# Altium schematic sheet EEM_Connectors.SchDoc
size 420 x 297 mm; EDA_Number: ARTIQ; CompanyName: WUT ISE; Organization: WUT ISE; DocumentNumber: 5; SheetNumber: 11; Title2: EEM Connectors, JTAG switches; SPICEModelCacheVGBTAUBO: <root> / <DocumentId>VGBTAUBO</DocumentId> / </root>; ModifiedDate: -
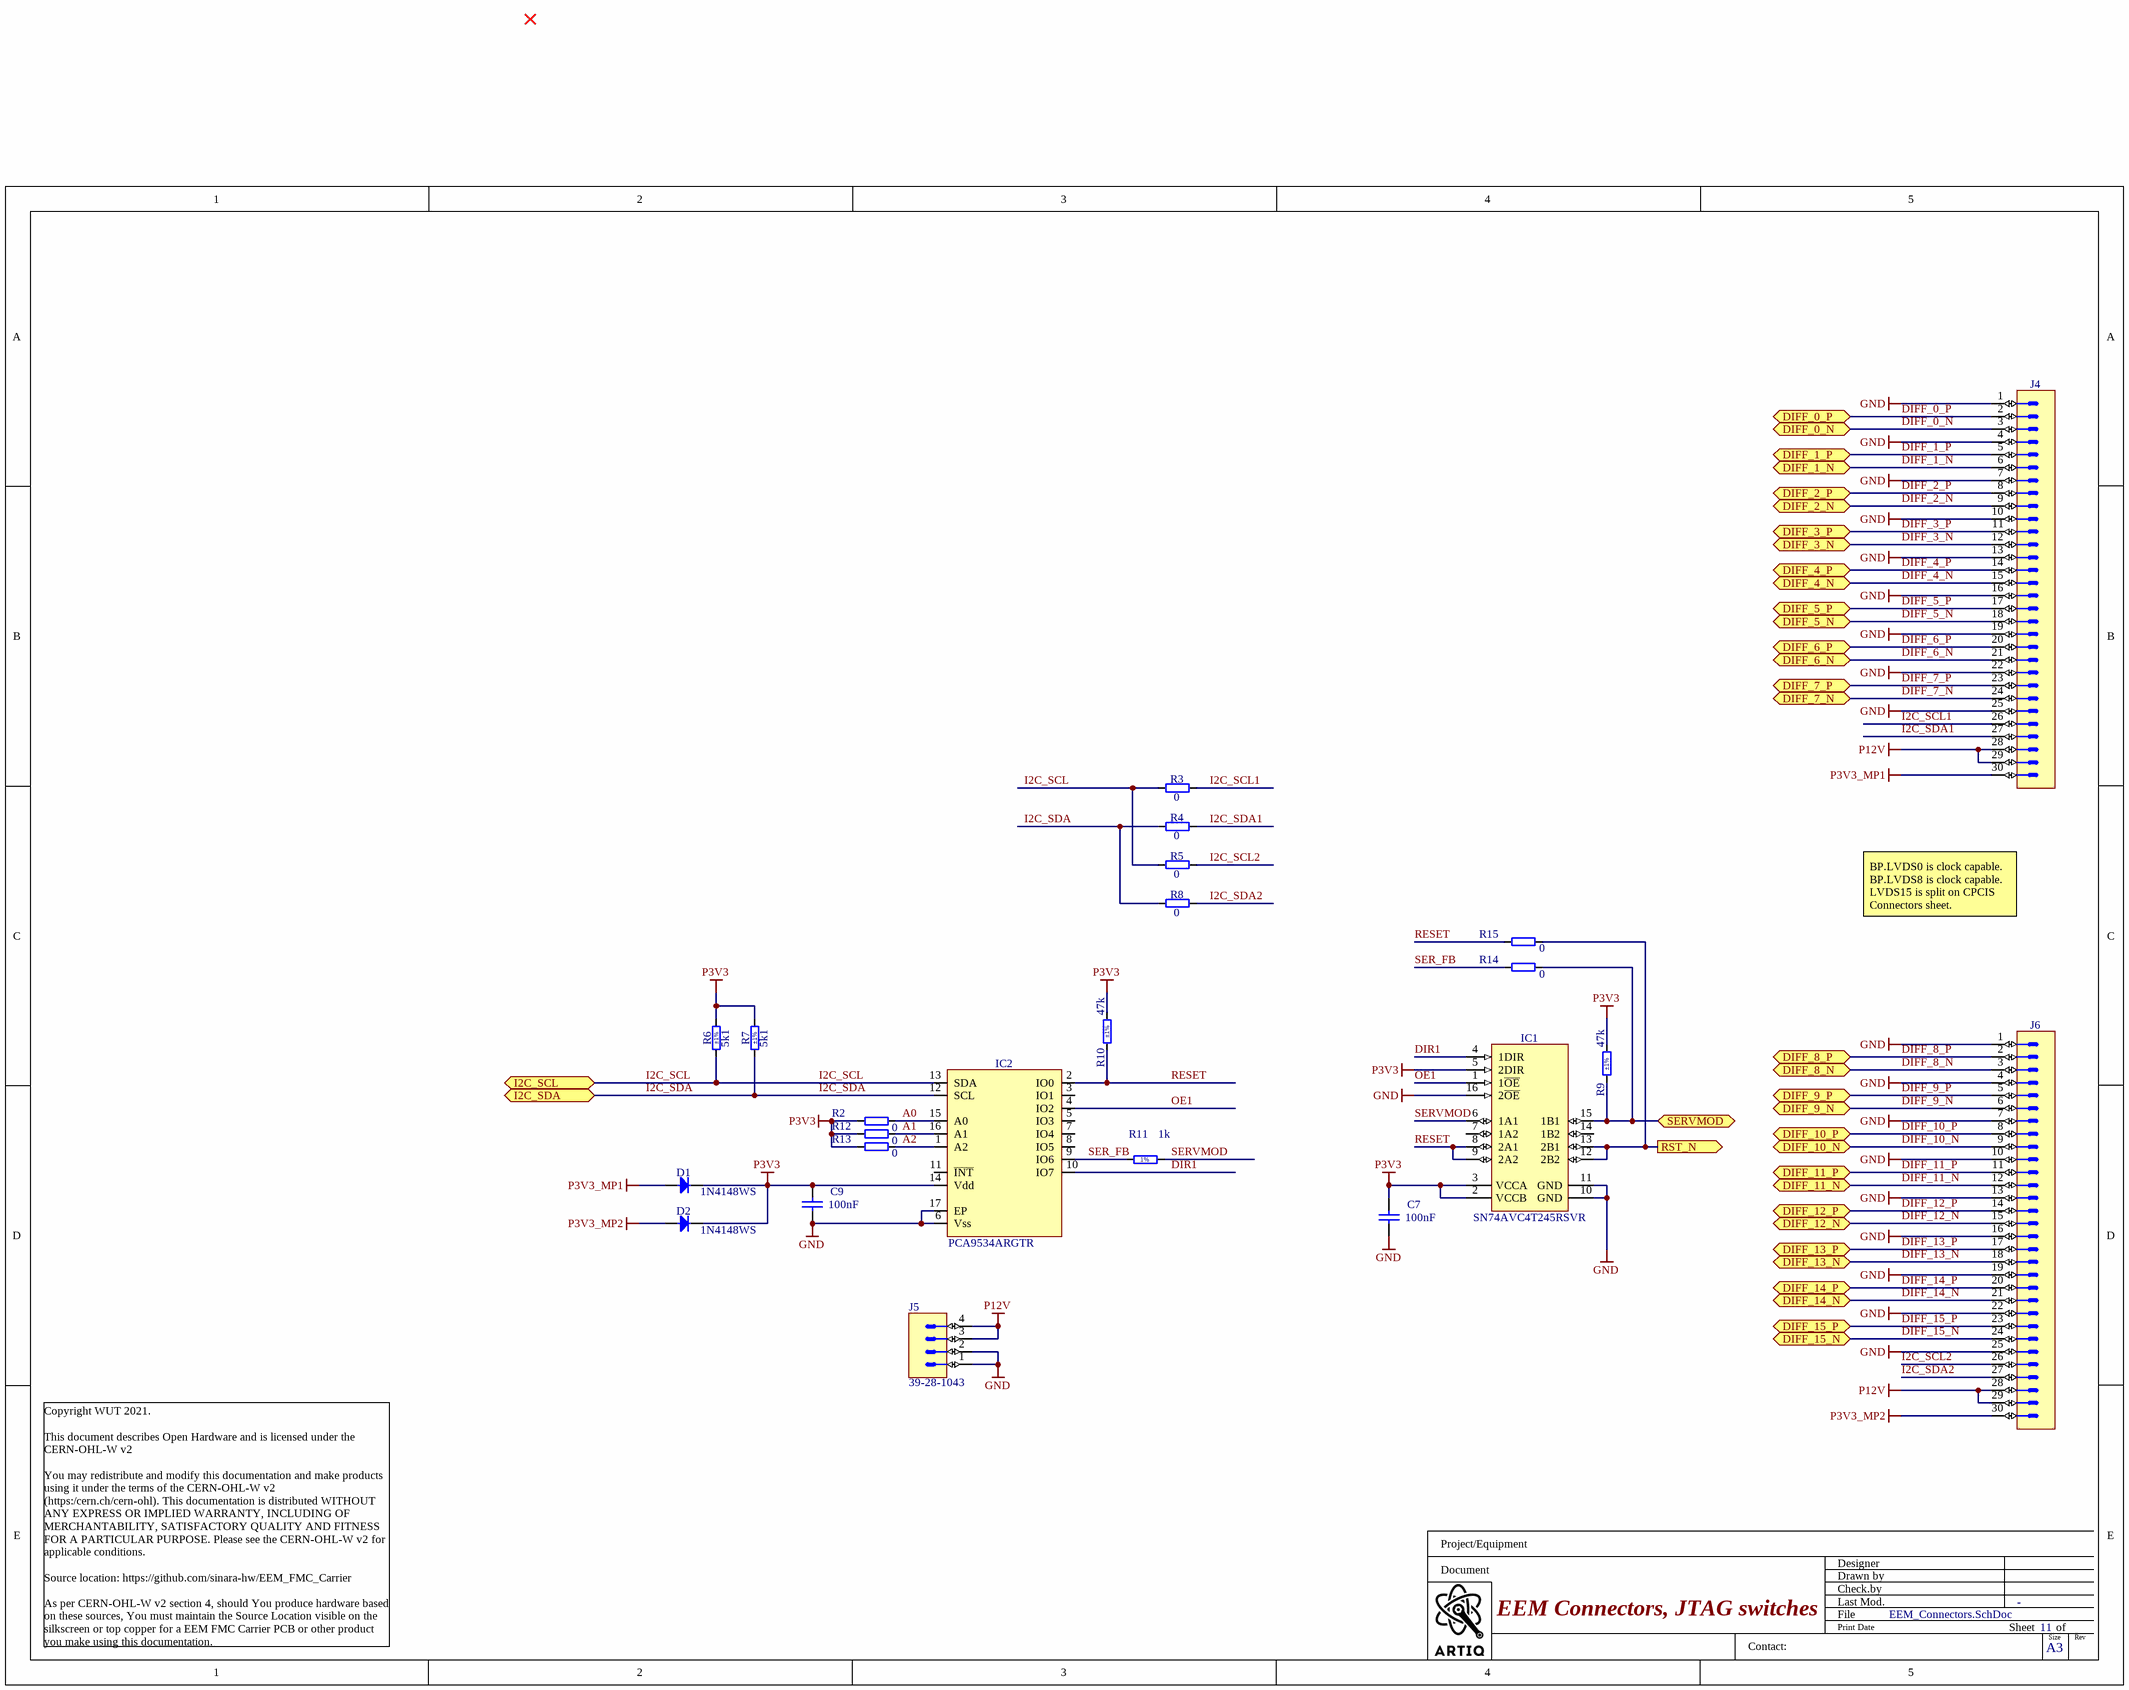
[diagram p0: EEM_Connectors.SchDoc]

## Parts
C7  100nF  [CAPC1005X55N]
C9  100nF  [CAPC1005X55N]
D1  1N4148WS  [SODFL2512X100N]
D2  1N4148WS  [SODFL2512X100N]
IC1  SN74AVC4T245RSVR  [QFN40P180X260X55-16N]
IC2  PCA9534ARGTR  [HVQFN-16]
J4  (no value)  [3M_N2530-6002RB]
J5  Manufacturer Part Number: 39-28-1043  [MOLEX_39-28-1043]  (hidden comment: Mini-Fit Jr.™)
J6  (no value)  [3M_N2530-6002RB]
R2  0  [RESC1005X40N]
R3  0  [RESC1005X40N]
R4  0  [RESC1005X40N]
R5  0  [RESC1005X40N]
R6  5k1  Tolerance: ±1%  [RESC1005X40N]
R7  5k1  Tolerance: ±1%  [RESC1005X40N]
R8  0  [RESC1005X40N]
R9  47k  Tolerance: ±1%  [RESC1005X40N]
R10  47k  Tolerance: ±1%  [RESC1005X40N]
R11  1k  [RESC1005X40N]
R12  0  [RESC1005X40N]
R13  0  [RESC1005X40N]
R14  0  [RESC1005X40N]
R15  0  [RESC1005X40N]

## Ports
DIFF_0_N (bidir), DIFF_0_P (bidir), DIFF_1_N (bidir), DIFF_1_P (bidir), DIFF_2_N (bidir), DIFF_2_P (bidir), DIFF_3_N (bidir), DIFF_3_P (bidir), DIFF_4_N (bidir), DIFF_4_P (bidir), DIFF_5_N (bidir), DIFF_5_P (bidir), DIFF_6_N (bidir), DIFF_6_P (bidir), DIFF_7_N (bidir), DIFF_7_P (bidir), DIFF_8_N (bidir), DIFF_8_P (bidir), DIFF_9_N (bidir), DIFF_9_P (bidir), DIFF_10_N (bidir), DIFF_10_P (bidir), DIFF_11_N (bidir), DIFF_11_P (bidir), DIFF_12_N (bidir), DIFF_12_P (bidir), DIFF_13_N (bidir), DIFF_13_P (bidir), DIFF_14_N (bidir), DIFF_14_P (bidir), DIFF_15_N (bidir), DIFF_15_P (bidir), I2C_SCL (bidir), I2C_SDA (bidir), RST_N (out), SERVMOD (bidir)

## Nets
GND: C7.2 C9.2 IC1.10(GND) IC1.11(GND) IC1.16(2~{OE}) IC2.6(Vss) IC2.17(EP) J4.1 J4.4 J4.7 J4.10 J4.13 J4.16 J4.19 J4.22 J4.25 J5.1 J5.2 J6.1 J6.4 J6.7 J6.10 J6.13 J6.16 J6.19 J6.22 J6.25
P3V3: C7.1 C9.1 D1.1(C) D2.1(C) IC1.2(VCCB) IC1.3(VCCA) IC1.5(2DIR) IC2.14(Vdd) R2.1 R6.2 R7.2 R9.2 R10.2 R12.1 R13.1
P3V3_MP1: D1.2(A) J4.30
P3V3_MP2: D2.2(A) J6.30
P12V: J4.28 J4.29 J5.3 J5.4 J6.28 J6.29
A0: IC2.15(A0) R2.2
A1: IC2.16(A1) R12.2
A2: IC2.1(A2) R13.2
DIFF_0_N: J4.3 ; port DIFF_0_N
DIFF_0_P: J4.2 ; port DIFF_0_P
DIFF_1_N: J4.6 ; port DIFF_1_N
DIFF_1_P: J4.5 ; port DIFF_1_P
DIFF_2_N: J4.9 ; port DIFF_2_N
DIFF_2_P: J4.8 ; port DIFF_2_P
DIFF_3_N: J4.12 ; port DIFF_3_N
DIFF_3_P: J4.11 ; port DIFF_3_P
DIFF_4_N: J4.15 ; port DIFF_4_N
DIFF_4_P: J4.14 ; port DIFF_4_P
DIFF_5_N: J4.18 ; port DIFF_5_N
DIFF_5_P: J4.17 ; port DIFF_5_P
DIFF_6_N: J4.21 ; port DIFF_6_N
DIFF_6_P: J4.20 ; port DIFF_6_P
DIFF_7_N: J4.24 ; port DIFF_7_N
DIFF_7_P: J4.23 ; port DIFF_7_P
DIFF_8_N: J6.3 ; port DIFF_8_N
DIFF_8_P: J6.2 ; port DIFF_8_P
DIFF_9_N: J6.6 ; port DIFF_9_N
DIFF_9_P: J6.5 ; port DIFF_9_P
DIFF_10_N: J6.9 ; port DIFF_10_N
DIFF_10_P: J6.8 ; port DIFF_10_P
DIFF_11_N: J6.12 ; port DIFF_11_N
DIFF_11_P: J6.11 ; port DIFF_11_P
DIFF_12_N: J6.15 ; port DIFF_12_N
DIFF_12_P: J6.14 ; port DIFF_12_P
DIFF_13_N: J6.18 ; port DIFF_13_N
DIFF_13_P: J6.17 ; port DIFF_13_P
DIFF_14_N: J6.21 ; port DIFF_14_N
DIFF_14_P: J6.20 ; port DIFF_14_P
DIFF_15_N: J6.24 ; port DIFF_15_N
DIFF_15_P: J6.23 ; port DIFF_15_P
DIR1: IC1.4(1DIR) IC2.10(IO7)
I2C_SCL: IC2.13(SDA) R3.1 R5.1 R6.1 ; port I2C_SCL
I2C_SCL1: J4.26 R3.2
I2C_SCL2: J6.26 R5.2
I2C_SDA: IC2.12(SCL) R4.1 R7.1 R8.1 ; port I2C_SDA
I2C_SDA1: J4.27 R4.2
I2C_SDA2: J6.27 R8.2
OE1: IC1.1(1~{OE}) IC2.4(IO2)
RESET: IC1.8(2A1) IC1.9(2A2) IC2.2(IO0) R10.1 R15.1
RST_N: IC1.12(2B2) IC1.13(2B1) R15.2 ; port RST_N
SER_FB: IC2.9(IO6) R11.1 R14.1
SERVMOD: IC1.15(1B1) R9.1 R14.2 ; port SERVMOD
SERVMOD: IC1.6(1A1) R11.2  [a separate net that carries the same name]

Not connected (* = marked no-connect by the designer): IC1 7(1A2) 14(1B2); IC2 3(IO1) 5(IO3) 7(IO4) 8(IO5) 11(~{INT})

## Notes on the sheet
- BP.LVDS0 is clock capable.
  BP.LVDS8 is clock capable.
  LVDS15 is split on CPCIS Connectors sheet.
- Project/Equipment
- Document
- Designer
- Drawn by
- Check.by
- Copyright WUT 2021.
  This document describes Open Hardware and is licensed under the CERN-OHL-W v2
  You may redistribute and modify this documentation and make products using it under the terms of the CERN-OHL-W v2 (https:/cern.ch/cern-ohl). This documentation is distributed WITHOUT ANY EXPRESS OR IMPLIED WARRANTY, INCLUDING OF MERCHANTABILITY, SATISFACTORY QUALITY AND FITNESS FOR A PARTICULAR PURPOSE. Please see the CERN-OHL-W v2 for applicable conditions.
  Source location: https://github.com/sinara-hw/EEM_FMC_Carrier
  As per CERN-OHL-W v2 section 4, should You produce hardware based on these sources, You must maintain the Source Location visible on the silkscreen or top copper for a EEM FMC Carrier PCB or other product you make using this documentation.
- Contact:
- File
- Last Mod.
- Print Date
- Sheet
- Size
- A3
- of
- Rev
- (in symbol R0402_1K_1%_0.0625W_100PPM) 1%

## Library data of the parts
C7 C9 = CC0402_100NF_25V_10%_X7R_YUDEN_TMK105B7104KVHF: Non-polarised capacitor; Part Description: SMD Multilayer Chip Ceramic Capacitor (High Dielectric Type) for Automotive / Industrial Applications; Manufacturer: TAIYO YUDEN; Voltage: 25V; TC: X7R; Tolerance: ±10%; Part Number: CC0402_100NF_25V_10%_X7R_YUDEN_TMK105B7104KVHF; Component Kind: Standard; Component Type: Standard; Pin Count: 2; Value: 100nF; Status: Not Recommended; Manufacturer Part Number: TMK105B7104KVHF; Case: 0402; Mounted: Yes; Socket: No; SMD: Yes; Sense: No; ComponentHeight: 0.55mm; HelpURL: \\cern.ch\dfs\Applications\Altium\Datasheets\CC0402_TAIYO-YUDEN_TMK105B7104KVHF.pdf; Author: CERN DEM JLC; CreateDate: 10.05.2017; LatestRevisionDate: 10.05.2017
D1 D2 = 1N4148WS: Diode; Part Description: Small Signal Diodes; Manufacturer: FAIRCHILD SEMICONDUCTOR; Voltage: 75V; Power: 150mA; PressFit: No; Bonding: No; Part Number: 1N4148WS; Component Kind: Standard; Component Type: Standard; Device: 1N4148WS; PackageDescription: SODFL Diode (SOD323F); 1.70mm W X 1.25mm L X 1.00mm H body, IPC Medium Density; Manufacturer Part Number: 1N4148WS; Pin Count: 2; Case: SOD-323F; Mounted: Yes; Socket: No; SMD: Yes; Sense: No; ComponentHeight: 1mm; HelpURL: \\cern.ch\dfs\Applications\Altium\Datasheets\1N4148WS.pdf; Author: CERN DEM JLC; CreateDate: 12.05.2011; LatestRevisionDate: 12.05.2011
IC1 = SN74AVC4T245RSVR: 4-Bit Dual-Supply Bus Transceiver with Configurable Voltage Translation and 3-State Output; Part Description: 4-Bit Dual-Supply Bus Transceiver with Configurable Voltage Translation and 3-State Outputs; Manufacturer: TEXAS INSTRUMENTS; PressFit: No; Bonding: No; Part Number: SN74AVC4T245RSVR; Component Kind: Standard; Component Type: Standard; Device: SN74AVC4T245RSVR; PackageDescription: QFN, 0.40mm Pitch, Rect.; 16 Pin, 2.60mm L X 1.80mm W X 0.55mm H Body, IPC Medium Density; Status: Not Recommended; Manufacturer Part Number: SN74AVC4T245RSVR; Pin Count: 16; Case: QFN16; Mounted: Yes; Socket: No; SMD: Yes; Sense: No; ComponentHeight: 0.55mm; Author: CERN DEM JLC; HelpURL: \\cern.ch\dfs\Applications\Altium\Datasheets\SN74AVC4T245RSVR.pdf; CreateDate: 08.07.2014; LatestRevisionDate: 30.03.2017
IC2 = PCA9534ARGTR: 8-bit I2C-bus and SMBus low power I/O port with interrupt; Manufacturer: NXP SEMICONDUCTORS; PressFit: No; Bonding: No; Part Number: PCA9534ARGTR; Component Kind: Standard; Component Type: Standard; Device: PCA9534ARGTR; PackageDescription: PCA9534ARGTR; Part Description: 8-bit I2C-bus and SMBus low power I/O port with interrupt; Manufacturer Part Number: PCA9534ARGTR; Pin Count: 16; Case: HVQFN-16; Mounted: Yes; Socket: No; SMD: Yes; Sense: No; ComponentHeight: 1.0mm; Author: CERN DEM BC; CreateDate: 2.01.2025; LatestRevisionDate: 2.01.2025
J4 J6 = 3M_N2530-6002RB: Connector 30 Male; Part Description: 30 Contacts - Straight .100'' x .100'' Low Profile Four-Wall Header, 2500 Series; Manufacturer: 3M; PressFit: No; Part Number: 3M_N2530-6002RB; Component Kind: Standard; Component Type: Standard; Pin Count: 30; Family: Header 30; Mounted: Yes; Socket: No; SMD: No; Sense: No; Status: None; Manufacturer Part Number: N2530-6002RB; ComponentHeight: 10.03mm; HelpURL: \\cern.ch\dfs\Applications\Altium\Datasheets\3M_N2530-6002RB.pdf; Author: CERN DEM JLC; CreateDate: 11.02.2009; LatestRevisionDate: 11.08.2009
J5 = MOLEX_39-28-1043: Connector 4 Male; Part Description: 4.20mm (.165") Pitch Mini-Fit Jr.™ Header, Dual Row, Vertical, without Snap-in Plastic Peg PCB Lock, 4 Circuits; Manufacturer: MOLEX; PressFit: No; Part Number: MOLEX_39-28-1043; Component Kind: Standard; Component Type: Standard; Pin Count: 4; Family: Mini-Fit Jr.™; Mounted: Yes; Socket: No; SMD: No; Sense: No; Status: None; ComponentHeight: 13.1mm; HelpURL: \\cern.ch\dfs\Applications\Altium\Datasheets\MOLEX_39-28-1043.pdf; Author: CERN DEM JLC; CreateDate: 12.03.2009; LatestRevisionDate: 06.03.2012
R2-R5 R8 R12-R15 = R0402_0R_JUMPER: Resistor; Part Description: 1A (0.05R Max DC Resistance) Zero Ohm Jumper; Manufacturer: GENERIC; Manufacturer1 Part Number: 232270591001L; PressFit: No; Part Number: R0402_0R_JUMPER; Component Kind: Standard; Component Type: Standard; Pin Count: 2; Value: 0; Status: Not Recommended; Manufacturer Part Number: R0402_0R_JUMPER; Case: 0402; Mounted: Yes; Sense: No; Socket: No; SMD: Yes; Manufacturer1 Example: YAGEO PHYCOMP; Manufacturer1 ComponentHeight: 0.4mm; HelpURL: \\cern.ch\dfs\Applications\Altium\Datasheets\R0402_Phycomp_RC0402.pdf; Author: CERN DEM JLC; CreateDate: 03.12.2007; LatestRevisionDate: 17.10.2012
R6 R7 = R0402_5K1_1%_0.0625W_100PPM: Resistor - 1%; Part Description: General Purpose Thick Film Chip Resistor; Manufacturer: GENERIC; Manufacturer1 Part Number: 232270675102L; TC: ±100ppm/°C; PressFit: No; Part Number: R0402_5K1_1%_0.0625W_100PPM; Component Kind: Standard; Component Type: Standard; Pin Count: 2; Value: 5k1; Status: Not Recommended; Power: 0.0625W; Manufacturer Part Number: R0402_5K1_1%_0.0625W_100PPM; Case: 0402; Mounted: Yes; Sense: No; Socket: No; SMD: Yes; Manufacturer1 Example: YAGEO PHYCOMP; Manufacturer1 ComponentHeight: 0.4mm; HelpURL: \\cern.ch\dfs\Applications\Altium\Datasheets\R0402_Phycomp_RC0402.pdf; Author: CERN DEM JLC; CreateDate: 03.12.2007; LatestRevisionDate: 17.10.2012
R9 R10 = R0402_47K_1%_0.0625W_100PPM: Resistor - 1%; Part Description: General Purpose Thick Film Chip Resistor; Manufacturer: GENERIC; Manufacturer1 Part Number: 232270674703L; TC: ±100ppm/°C; PressFit: No; Part Number: R0402_47K_1%_0.0625W_100PPM; Component Kind: Standard; Component Type: Standard; Pin Count: 2; Value: 47k; Status: Not Recommended; Power: 0.0625W; Manufacturer Part Number: R0402_47K_1%_0.0625W_100PPM; Case: 0402; Mounted: Yes; Sense: No; Socket: No; SMD: Yes; Manufacturer1 Example: YAGEO PHYCOMP; Manufacturer1 ComponentHeight: 0.4mm; HelpURL: \\cern.ch\dfs\Applications\Altium\Datasheets\R0402_Phycomp_RC0402.pdf; Author: CERN DEM JLC; CreateDate: 03.12.2007; LatestRevisionDate: 17.10.2012
R11 = R0402_1K_1%_0.0625W_100PPM: Resistor - 1%; Part Description: General Purpose Thick Film Chip Resistor; Manufacturer: GENERIC; Manufacturer1 Part Number: 232270671002L; TC: ±100ppm/°C; PressFit: No; Part Number: R0402_1K_1%_0.0625W_100PPM; Component Kind: Standard; Component Type: Standard; Pin Count: 2; Value: 1k; Status: Not Recommended; Power: 0.0625W; Tolerance: ±1%; Manufacturer Part Number: R0402_1K_1%_0.0625W_100PPM; Case: 0402; Mounted: Yes; Sense: No; Socket: No; SMD: Yes; Manufacturer1 Example: YAGEO PHYCOMP; Manufacturer1 ComponentHeight: 0.4mm; HelpURL: \\cern.ch\dfs\Applications\Altium\Datasheets\R0402_Phycomp_RC0402.pdf; Author: CERN DEM JLC; CreateDate: 03.12.2007; LatestRevisionDate: 17.10.2012; ClassName: Artix